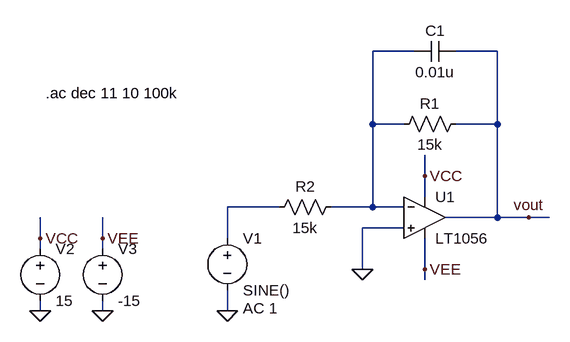
[diagram p0: schematic sample2_lpf.asc]
sample2_lpf.asc, the LTspice schematic file:
Version 4
SHEET 1 892 680
WIRE 400 -144 336 -144
WIRE 528 -144 464 -144
WIRE 336 -32 336 -144
WIRE 384 -32 336 -32
WIRE 528 -32 528 -144
WIRE 528 -32 464 -32
WIRE 416 48 416 16
WIRE 416 80 416 48
WIRE 192 96 112 96
WIRE 336 96 336 -32
WIRE 336 96 272 96
WIRE 384 96 336 96
WIRE 528 112 528 -32
WIRE 528 112 448 112
WIRE 576 112 528 112
WIRE 608 112 576 112
WIRE 384 128 320 128
WIRE -176 144 -176 112
WIRE -80 144 -80 112
WIRE 112 144 112 96
WIRE -176 160 -176 144
WIRE -80 160 -80 144
WIRE 320 192 320 128
WIRE 416 192 416 144
WIRE 416 208 416 192
WIRE -176 256 -176 240
WIRE -80 256 -80 240
WIRE 112 256 112 224
FLAG 112 256 0
FLAG 320 192 0
FLAG 576 112 vout
FLAG -176 256 0
FLAG -80 256 0
FLAG -176 144 VCC
FLAG 416 48 VCC
FLAG -80 144 VEE
FLAG 416 192 VEE
DATAFLAG 528 112 ""
SYMBOL voltage 112 128 R0
WINDOW 123 24 124 Left 2
WINDOW 39 0 0 Left 2
SYMATTR Value2 AC 1
SYMATTR InstName V1
SYMATTR Value SINE()
SYMBOL res 480 -48 R90
WINDOW 0 0 56 VBottom 2
WINDOW 3 32 56 VTop 2
SYMATTR InstName R1
SYMATTR Value 15k
SYMBOL cap 464 -160 R90
WINDOW 0 0 32 VBottom 2
WINDOW 3 32 32 VTop 2
SYMATTR InstName C1
SYMATTR Value 0.01u
SYMBOL voltage -176 144 R0
WINDOW 123 0 0 Left 2
WINDOW 39 0 0 Left 2
SYMATTR InstName V2
SYMATTR Value 15
SYMBOL voltage -80 144 R0
WINDOW 123 0 0 Left 2
WINDOW 39 0 0 Left 2
SYMATTR InstName V3
SYMATTR Value -15
SYMBOL Opamps\\LT1056 416 48 R0
SYMATTR InstName U1
SYMBOL res 288 80 R90
WINDOW 0 0 56 VBottom 2
WINDOW 3 32 56 VTop 2
SYMATTR InstName R2
SYMATTR Value 15k
TEXT -168 -80 Left 2 !.ac dec 11 10 100k

The netlist it stands for:
* sample2_lpf.asc
V1 N002 0 SINE() AC 1
R1 vout N001 15k
C1 vout N001 0.01u
V2 VCC 0 15
V3 VEE 0 -15
XU1 0 N001 VCC VEE vout LT1056  ; pins In+ In- V+ V- OUT
R2 N001 N002 15k
.ac dec 11 10 100k
.backanno
.end

* Results of the author's LTspice run, read from the files saved beside the schematic
* Operating Point, zero values left out:
*   V(vcc) = 15 V
*   V(vee) = -15 V
*   I(V3) = 5 mA
*   I(V2) = -5 mA
*   Ix(u1:3) = 5 mA
*   Ix(u1:4) = -5 mA
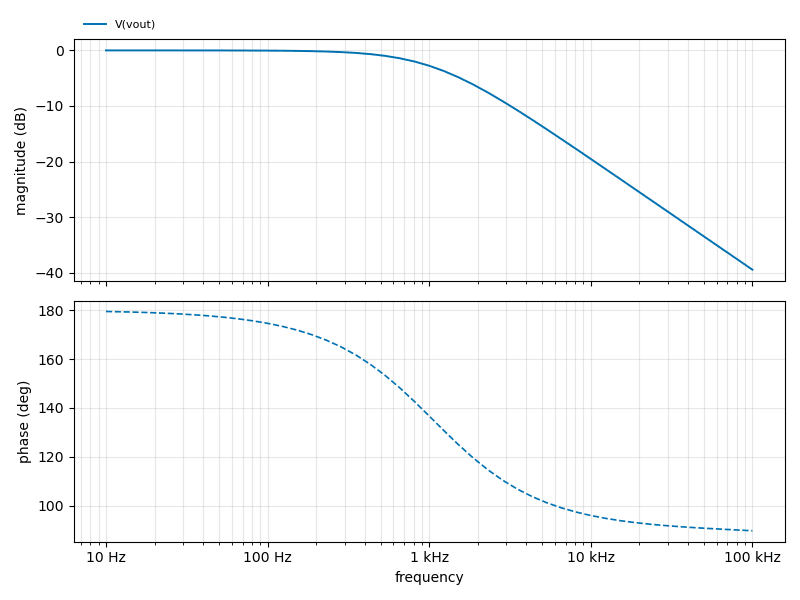
[diagram p1: AC Analysis of sample2_lpf.asc, plotted from the saved traces]
* AC Analysis, 1 run:
*   V(vout): -0.00 dB at 10 Hz, -39.46 dB at 100 kHz, peak -0.00 dB at 10 Hz, 3 dB below the peak at 1.056 kHz